# EAGLE design writelockswitches (EAGLE 6.6.0)
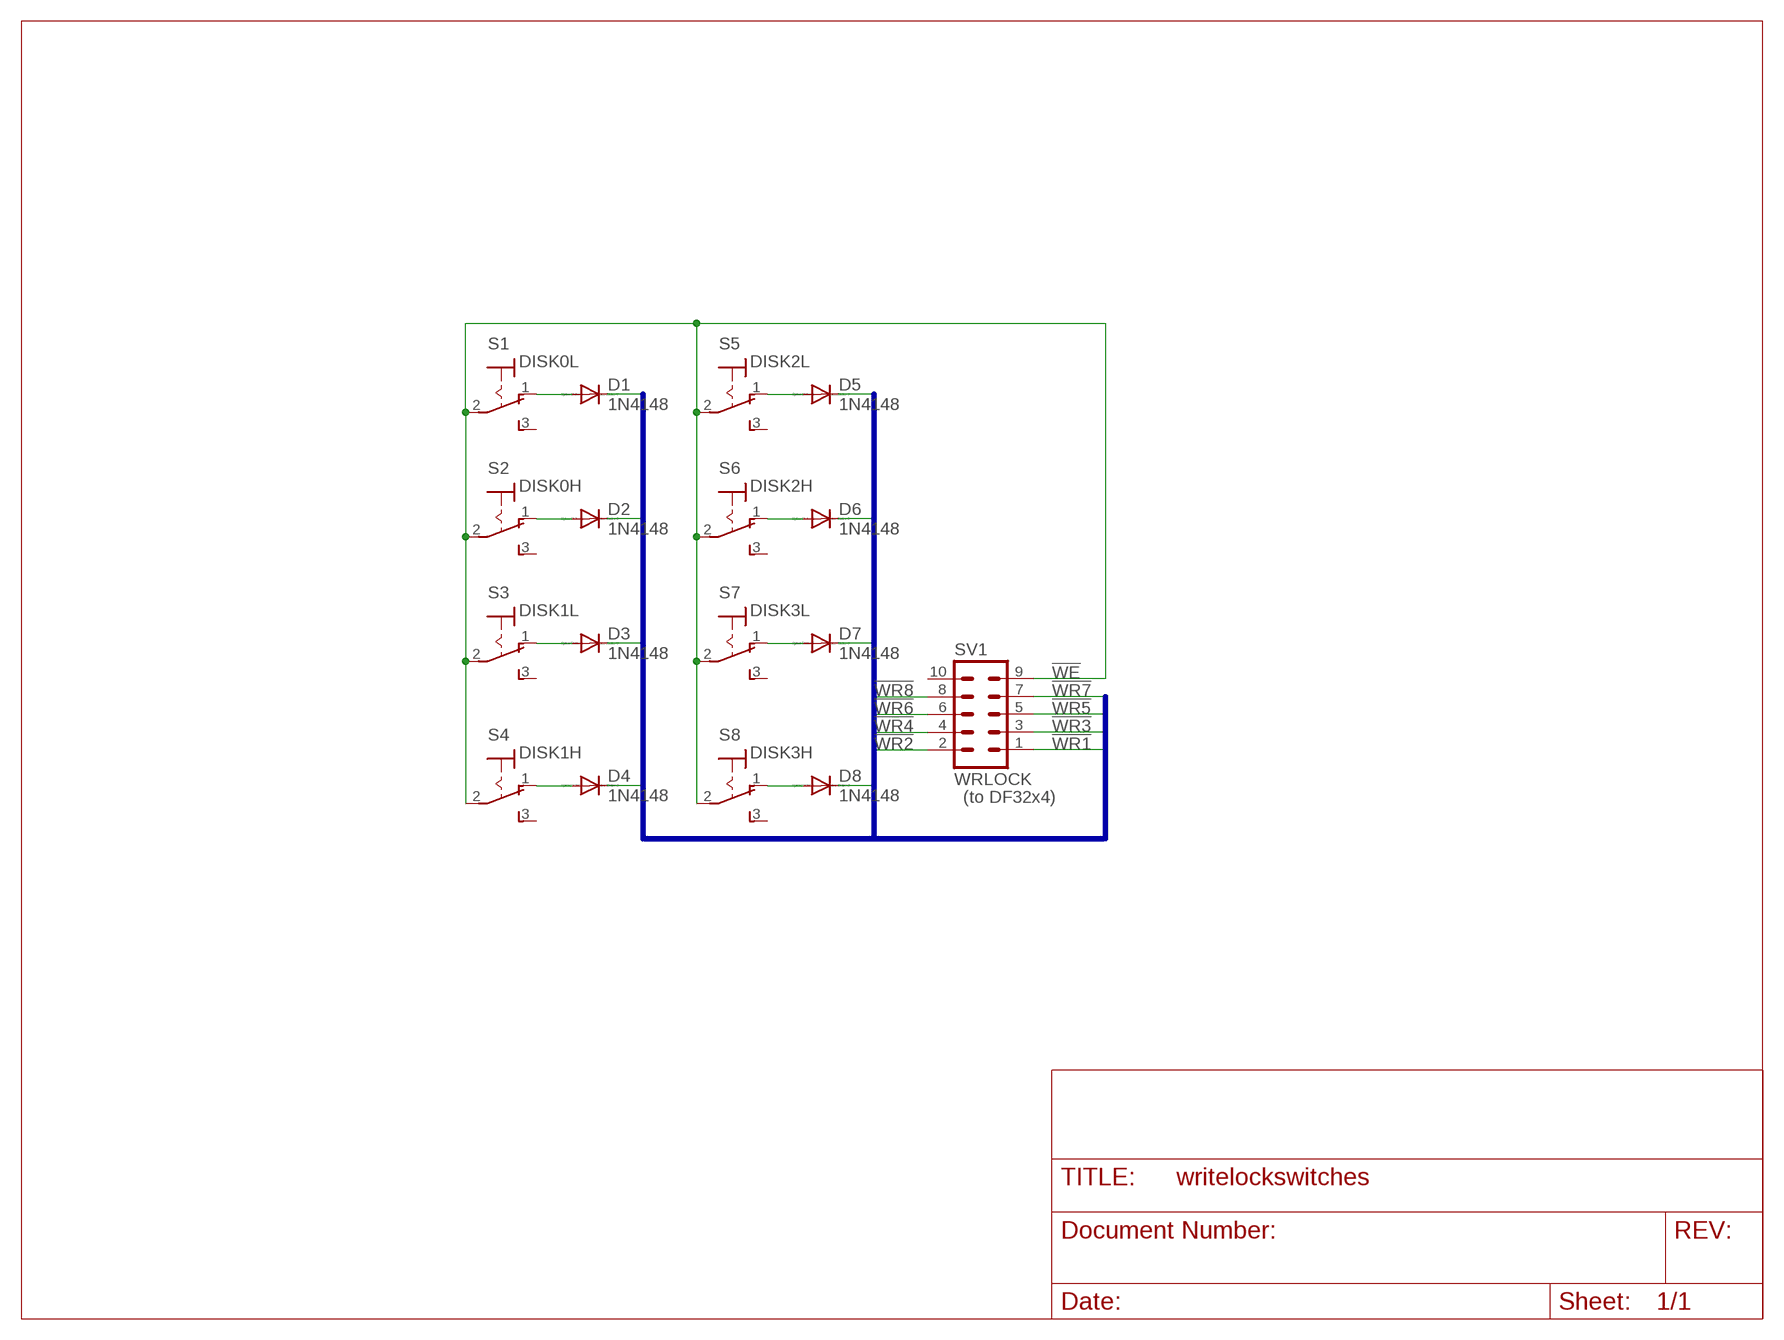
[diagram p0: schematic, sheet 1]

## Parts
D1  1N4148  1N4148DO35-10  [DO35-10]
D2  1N4148  1N4148DO35-10  [DO35-10]
D3  1N4148  1N4148DO35-10  [DO35-10]
D4  1N4148  1N4148DO35-10  [DO35-10]
D5  1N4148  1N4148DO35-10  [DO35-10]
D6  1N4148  1N4148DO35-10  [DO35-10]
D7  1N4148  1N4148DO35-10  [DO35-10]
D8  1N4148  1N4148DO35-10  [DO35-10]
S1  DISK0L  320-916  [320-916]
S2  DISK0H  320-916  [320-916]
S3  DISK1L  320-916  [320-916]
S4  DISK1H  320-916  [320-916]
S5  DISK2L  320-916  [320-916]
S6  DISK2H  320-916  [320-916]
S7  DISK3L  320-916  [320-916]
S8  DISK3H  320-916  [320-916]
SV1  WRLOCK  MA05-2  [MA05-2]

## Nets
!WE: S1.2(P) S2.2(P) S3.2(P) S4.2(P) S5.2(P) S6.2(P) S7.2(P) S8.2(P) SV1.9
!WR1: D1.C SV1.1
!WR2: D2.C SV1.2
!WR3: D3.C SV1.3
!WR4: D4.C SV1.4
!WR5: D5.C SV1.5
!WR6: D6.C SV1.6
!WR7: D7.C SV1.7
!WR8: D8.C SV1.8
N$1: D1.A S1.1(O)
N$2: D2.A S2.1(O)
N$3: D3.A S3.1(O)
N$4: D4.A S4.1(O)
N$5: D5.A S5.1(O)
N$6: D6.A S6.1(O)
N$7: D7.A S7.1(O)
N$8: D8.A S8.1(O)
Unconnected: S1.3(S) S2.3(S) S3.3(S) S4.3(S) S5.3(S) S6.3(S) S7.3(S) S8.3(S) SV1.10

## Buses
!WR[1..8]

## Notes on the sheet
- (to DF32x4)

## Library data of the parts
D1-D8 = diode:1N4148: DIODE high speed (Philips)
S1-S8 = switch:320-916: TOGGLE SWITCH distributor RS Components
SV1 = con-lstb:MA05-2: PIN HEADER; OC_FARNELL: unknown; OC_NEWARK: unknown

## Board
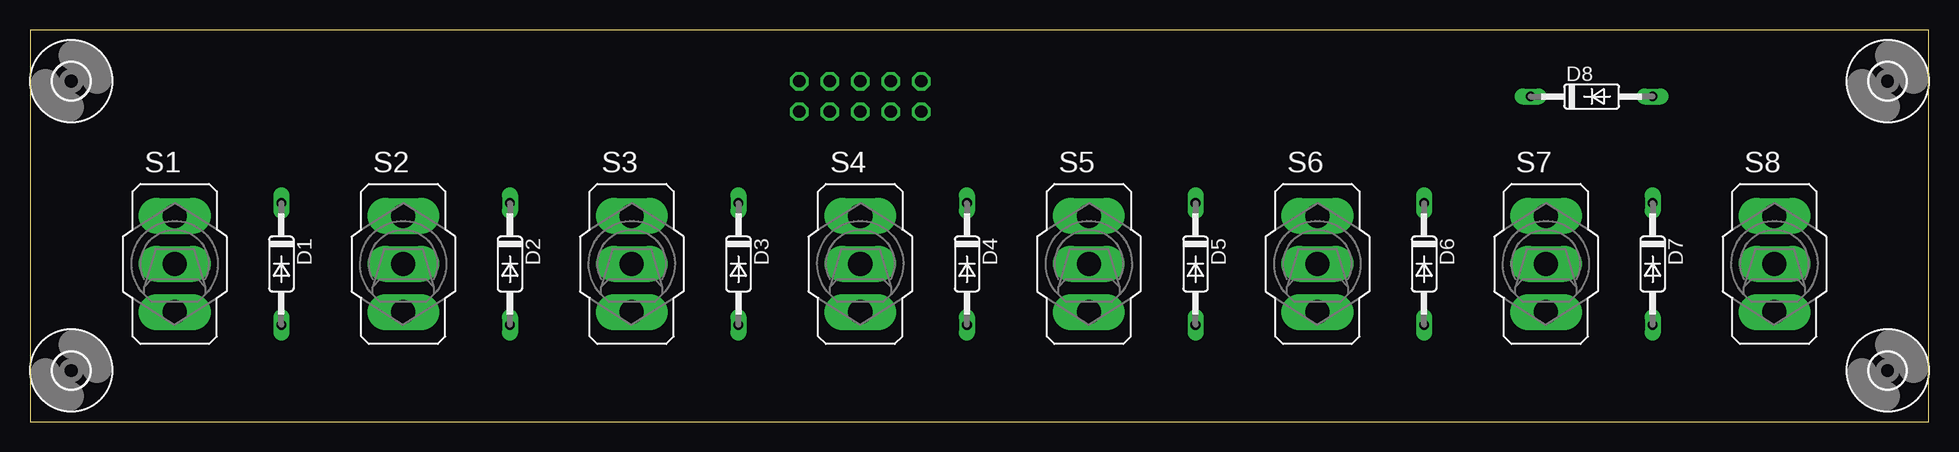
[diagram p1: board, top side]
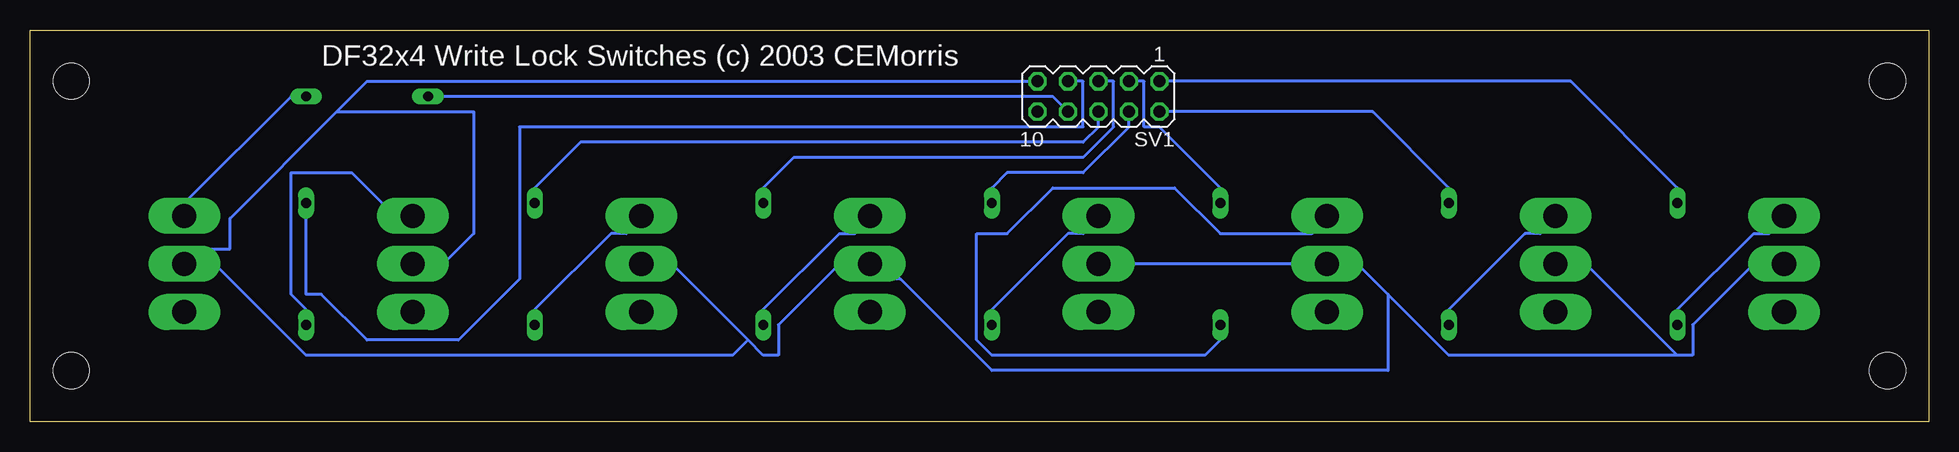
[diagram p2: board, bottom side, seen from below]

Size 158.27 x 32.69 mm. Coordinates in mm from the lower left corner, seen from the top.
Outline: 0,0 158.27,0 158.27,32.69 0,32.69 0,0
Copper layers 16: Bottom 0.035mm
Design rules "default": minimum track width 10mil, minimum drill 24mil, track to track 8mil, track to pad 8mil, pad to pad 8mil, via to via 8mil, smd to smd 8mil, copper to edge 40mil, drill to drill 8mil, minimum pad ring 10mil, minimum via ring 8mil, stop-mask expansion 4mil, vias tented up to drill 0mil, thermal gap 10mil

### Footprints (pad centres in the part's own frame; a part is rotated, then mirrored left to right if it is on the bottom)
DO35-10 = drill 0.813 long: A 5.08,0; C -5.08,0
320-916 = drill 2.007 long: 1 0,4.013; 2 0,0; 3 0,-4.013
MA05-2 = drill 1.016 octagon: 1 -5.08,-1.27; 2 -5.08,1.27; 3 -2.54,-1.27; 4 -2.54,1.27; 5 0,-1.27; 6 0,1.27; 7 2.54,-1.27; 8 2.54,1.27; 9 5.08,-1.27; 10 5.08,1.27
3,0 = hole 3: 0,0

### Placement (x,y rotation side)
D1  1N4148DO35-10  [DO35-10]  20.95,13.17 270 top
D2  1N4148DO35-10  [DO35-10]  40,13.17 270 top
D3  1N4148DO35-10  [DO35-10]  59.05,13.17 270 top
D4  1N4148DO35-10  [DO35-10]  78.1,13.17 270 top
D5  1N4148DO35-10  [DO35-10]  97.15,13.17 270 top
D6  1N4148DO35-10  [DO35-10]  116.2,13.17 270 top
D7  1N4148DO35-10  [DO35-10]  135.25,13.17 270 top
D8  1N4148DO35-10  [DO35-10]  130.17,27.14 0 top
S1  12.06,13.17 0 top
S2  31.11,13.17 0 top
S3  50.16,13.17 0 top
S4  69.21,13.17 0 top
S5  88.26,13.17 0 top
S6  107.31,13.17 0 top
S7  126.36,13.17 0 top
S8  145.41,13.17 0 top
SV1  69.21,27.14 180 bottom
U$1  [3,0]  3.44,28.41 0 top
U$2  [3,0]  3.44,4.28 0 top
U$3  [3,0]  154.84,28.41 0 top
U$4  [3,0]  154.84,4.28 0 top

### Tracks (layer width: path | path; a pad name or v marks a point on that pad's centre or on a via)
!WE
  Bottom 0.254: S4.2 S3.2 47.62,13.17 45.08,10.63 | 20.95,5.55 19.68,5.55 19.68,8.09 14.6,13.17 S1.2 | 20.95,5.55 28.57,13.17 S2.2 | 45.08,10.63 40,5.55 20.95,5.55 | 98.42,6.82 104.77,13.17 S6.2 | 98.42,6.82 97.15,5.55 95.88,5.55 95.88,8.09 90.8,13.17 S5.2 86.99,11.9 85.72,11.9 78.1,4.28 45.08,4.28 45.08,10.63 | SV1.9 130.17,28.41 132.71,25.87 | 132.71,25.87 141.6,16.98 141.6,14.44 144.14,14.44 S8.2 142.87,13.17 135.25,5.55 99.69,5.55 98.42,6.82 | 132.71,25.87 121.28,25.87 121.28,15.71 123.82,13.17 S7.2
!WR1
  Bottom 0.254: SV1.1 29.84,28.41 20.95,19.52 D1.C
!WR2
  Bottom 0.254: SV1.2 46.35,25.87 40,19.52 D2.C
!WR3
  Bottom 0.254: SV1.3 65.4,28.41 65.4,24.6 64.13,24.6 59.05,19.52 D3.C
!WR4
  Bottom 0.254: SV1.4 66.67,24.6 70.48,20.79 76.83,20.79 78.1,19.52 D4.C
!WR5
  Bottom 0.254: SV1.5 67.94,28.41 67.94,24.6 70.48,22.06 94.61,22.06 97.15,19.52 D5.C
!WR6
  Bottom 0.254: SV1.6 69.21,24.6 70.48,23.33 112.39,23.33 116.2,19.52 D6.C
!WR7
  Bottom 0.254: SV1.7 70.48,28.41 70.48,24.6 117.47,24.6 117.47,11.9 122.55,6.82 130.17,6.82 133.98,10.63 135.25,10.63 D7.C
!WR8
  Bottom 0.254: SV1.8 73.02,27.14 D8.C
N$1
  Bottom 0.254: D1.A 20.95,9.36 14.6,15.71 13.33,15.71 S1.1
N$2
  Bottom 0.254: D2.A 40,9.36 33.65,15.71 32.38,15.71 S2.1
N$3
  Bottom 0.254: D3.A 59.05,6.82 60.32,5.55 78.1,5.55 79.37,6.82 79.37,15.71 76.83,15.71 73.02,19.52 62.86,19.52 59.05,15.71 51.43,15.71 S3.1
N$4
  Bottom 0.254: D4.A 78.1,9.36 71.75,15.71 70.48,15.71 S4.1
N$5
  Bottom 0.254: D5.A 97.15,9.36 90.8,15.71 89.53,15.71 S5.1
N$6
  Bottom 0.254: D6.A 116.2,9.36 109.85,15.71 108.58,15.71 S6.1
N$7
  Bottom 0.254: D7.A 135.25,9.36 136.52,10.63 136.52,20.79 131.44,20.79 128.9,18.25 S7.1
N$8
  Bottom 0.254: D8.A 136.52,27.14 145.41,18.25 S8.1
N$9
  pour Top: 66.03,25.87 66.03,26.12 66.42,26.5 66.92,26.5 67.3,26.12 67.3,25.62 66.92,25.23 66.42,25.23 66.03,25.62
N$10
  pour Top: 63.5,28.41 63.5,28.66 63.88,29.04 64.38,29.04 64.77,28.66 64.77,28.16 64.38,27.77 63.88,27.77 63.5,28.16
N$11
  pour Top: 63.5,25.87 63.5,26.12 63.88,26.5 64.38,26.5 64.77,26.12 64.77,25.62 64.38,25.23 63.88,25.23 63.5,25.62
N$12
  pour Top: 66.03,28.41 66.03,28.66 66.42,29.04 66.92,29.04 67.3,28.66 67.3,28.16 66.92,27.77 66.42,27.77 66.03,28.16
N$13
  pour Top: 68.58,28.41 68.58,28.66 68.96,29.04 69.46,29.04 69.84,28.66 69.84,28.16 69.46,27.77 68.96,27.77 68.58,28.16
N$14
  pour Top: 71.11,28.41 71.11,28.66 71.5,29.04 72,29.04 72.39,28.66 72.39,28.16 72,27.77 71.5,27.77 71.24,28.03 71.11,28.16
N$15
  pour Top: 73.66,28.54 73.66,28.66 74.04,29.04 74.54,29.04 74.92,28.66 74.92,28.16 74.54,27.77 74.04,27.77 73.66,28.16 73.66,28.41
N$16
  pour Top: 68.58,25.87 68.58,26.12 68.96,26.5 69.46,26.5 69.84,26.12 69.84,25.62 69.46,25.23 68.96,25.23 68.7,25.49 68.58,25.62
N$17
  pour Top: 71.11,26.12 71.5,26.5 72,26.5 72.39,26.12 72.39,25.62 72,25.23 71.5,25.23 71.11,25.62
N$18
  pour Top: 73.66,25.87 73.66,26.12 74.04,26.5 74.54,26.5 74.92,26.12 74.92,25.62 74.54,25.23 74.04,25.23 73.66,25.62

### Text on the board
bPlace: DF32x4 Write Lock Switches (c) 2003 CEMorris